# Altium schematic sheet RGB Sencer.SchDoc
size 165 x 127 mm
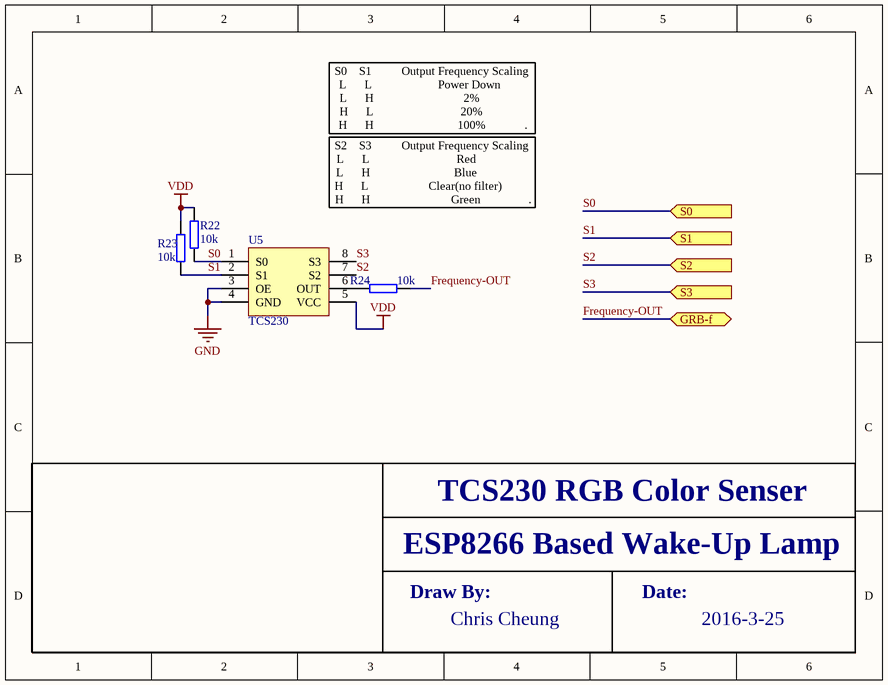
[diagram p0: RGB Sencer.SchDoc]

## Parts
R22  10k  [SMT_R_0402]
R23  10k  [SMT_R_0402]
R24  10k  [SMT_R_0402]
U5  value TCS230  [SO-8]  (hidden comment: Color sensor)

## Ports
GRB-f (bidir), S0 (in), S1 (in), S2 (in), S3 (in)

## Nets
GND: U5.3(OE) U5.4(GND)
VDD: R22.2 R23.2 U5.5(VCC)
Frequency-OUT: R24.2 ; port GRB-f
S0: R22.1 U5.1(S0) ; port S0
S1: R23.1 U5.2(S1) ; port S1
S2: U5.7(S2) ; port S2
S3: U5.8(S3) ; port S3
NetR24_1: R24.1 U5.6(OUT)

## Notes on the sheet
- S0    S1          Output Frequency Scaling
  L      L                      Power Down
  L      H                              2%
  H      L                             20%
  H      H                            100%             .
- S2    S3          Output Frequency Scaling
  L      L                             Red
  L      H                            Blue
  H      L                    Clear(no filter)
  H      H                           Green                .
- TCS230 RGB Color Senser
- ESP8266 Based Wake-Up Lamp
- Draw By:
- Chris Cheung
- Date:
- 2016-3-25

## Library data of the parts
R22-R24 = SMT_R_0402: Surface mount resistor 0402
U5 = TCS230